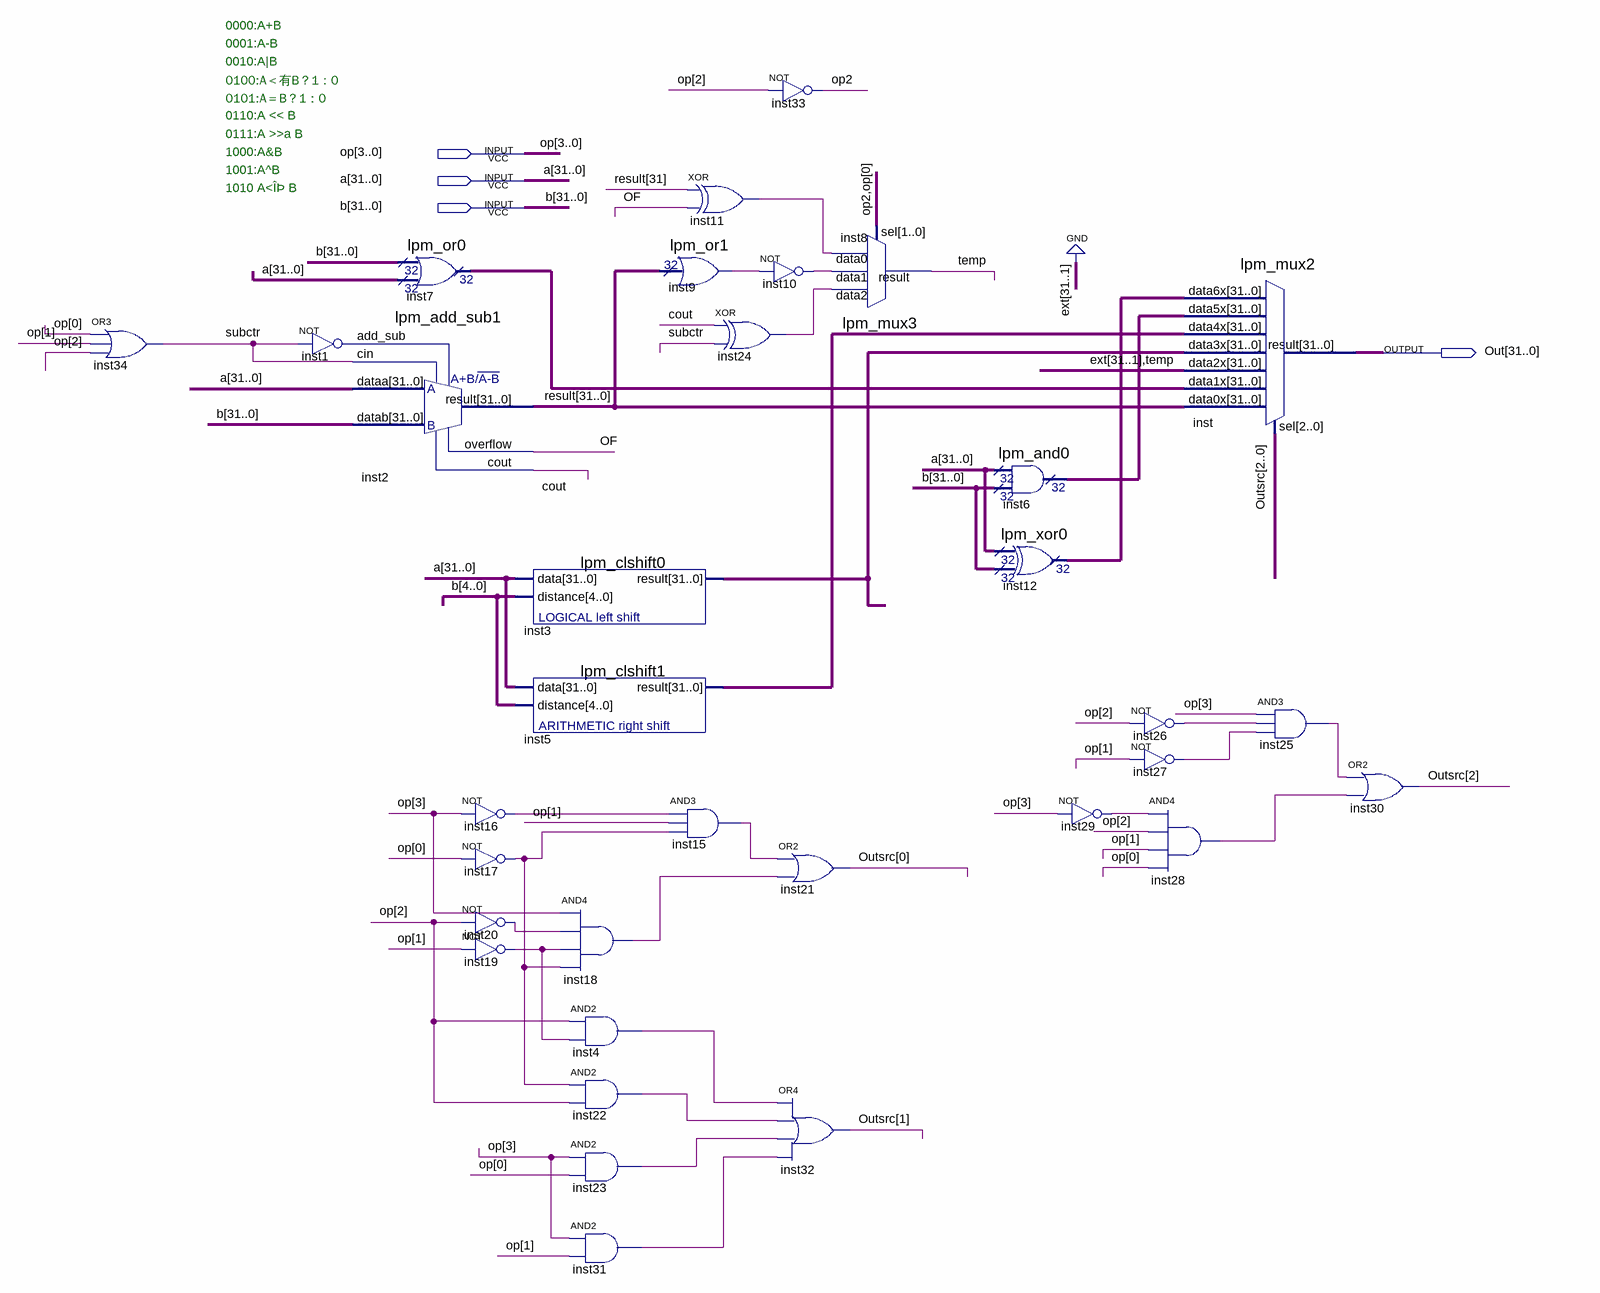
[diagram p0: schematic sheet]
// Quartus schematic ALU.bdf as structural Verilog: 33 symbols, 4 pins
module ALU (
  input  [3:0] op,
  input  [31:0] a,
  input  [31:0] b,
  output [31:0] Out
);

  wire cout, inst1_out, inst4_out, inst9_result, inst10_out, inst11_out, inst15_out, inst16_out, inst17_out,
       inst18_out, inst19_out, inst20_out, inst22_out, inst23_out, inst24_out, inst25_out, inst26_out,
       inst27_out, inst28_out, inst29_out, inst31_out, OF, subctr, temp;
  wire [2:0] Outsrc;
  wire [31:0] inst3_result, inst5_result, inst6_result, inst7_result, inst12_result, result;

  or inst34 (subctr, op[0], op[1], op[2]);
  not inst1 (inst1_out, subctr);
  lpm_or0 inst7 (.data0x(b), .data1x(a), .result(inst7_result));
  lpm_add_sub1 inst2 (
    .dataa(a), .datab(b), .add_sub(inst1_out), .cin(subctr), .result(result), .overflow(OF), .cout(cout));
  not inst16 (inst16_out, op[3]);
  not inst17 (inst17_out, op[0]);
  not inst20 (inst20_out, op[2]);
  not inst19 (inst19_out, op[1]);
  lpm_clshift0 inst3 (.data(a), .distance(b[4:0]), .result(inst3_result));
  lpm_clshift1 inst5 (.data(a), .distance(b[4:0]), .result(inst5_result));
  and inst18 (inst18_out, op[3], inst20_out, inst19_out, inst17_out);
  and inst4 (inst4_out, op[2], inst19_out);
  and inst22 (inst22_out, inst17_out, op[2]);
  and inst23 (inst23_out, op[3], op[0]);
  and inst31 (inst31_out, op[3], op[1]);
  xor inst11 (inst11_out, result[31], OF);
  lpm_or1 inst9 (.data(result), .result(inst9_result));
  and inst15 (inst15_out, inst16_out, op[1], inst17_out);
  not inst33 (op[2], op[2]);
  not inst10 (inst10_out, inst9_result);
  xor inst24 (inst24_out, cout, subctr);
  or inst21 (Outsrc[0], inst15_out, inst18_out);
  or inst32 (Outsrc[1], inst4_out, inst22_out, inst23_out, inst31_out);
  lpm_mux3 inst8 (.data2(inst24_out), .data1(inst10_out), .data0(inst11_out), .sel({op[2], op[0]}), .result(temp));
  lpm_and0 inst6 (.data0x(a), .data1x(b), .result(inst6_result));
  lpm_xor0 inst12 (.data0x(a), .data1x(b), .result(inst12_result));
  not inst29 (inst29_out, op[3]);
  not inst26 (inst26_out, op[2]);
  not inst27 (inst27_out, op[1]);
  lpm_mux2 inst (
    .data6x(inst12_result), .data5x(inst6_result), .data4x(inst5_result), .data3x(inst3_result),
    .data2x({{31{1'b0}}, temp}), .data1x(inst7_result), .data0x(result), .sel(Outsrc), .result(Out));
  and inst28 (inst28_out, inst29_out, op[2], op[1], op[0]);
  and inst25 (inst25_out, op[3], inst26_out, inst27_out);
  or inst30 (Outsrc[2], inst25_out, inst28_out);

  // Notes on the sheet:
  //   0000:A+B
  //   0001:A-B
  //   0010:A|B
  //   0100:A＜有B？1 : 0
  //   0101:A＝B？1 : 0
  //   0110:A << B
  //   0111:A >>a B
  //   1000:A&B
  //   1001:A^B
  //   1010 A<ÎÞ B
endmodule
